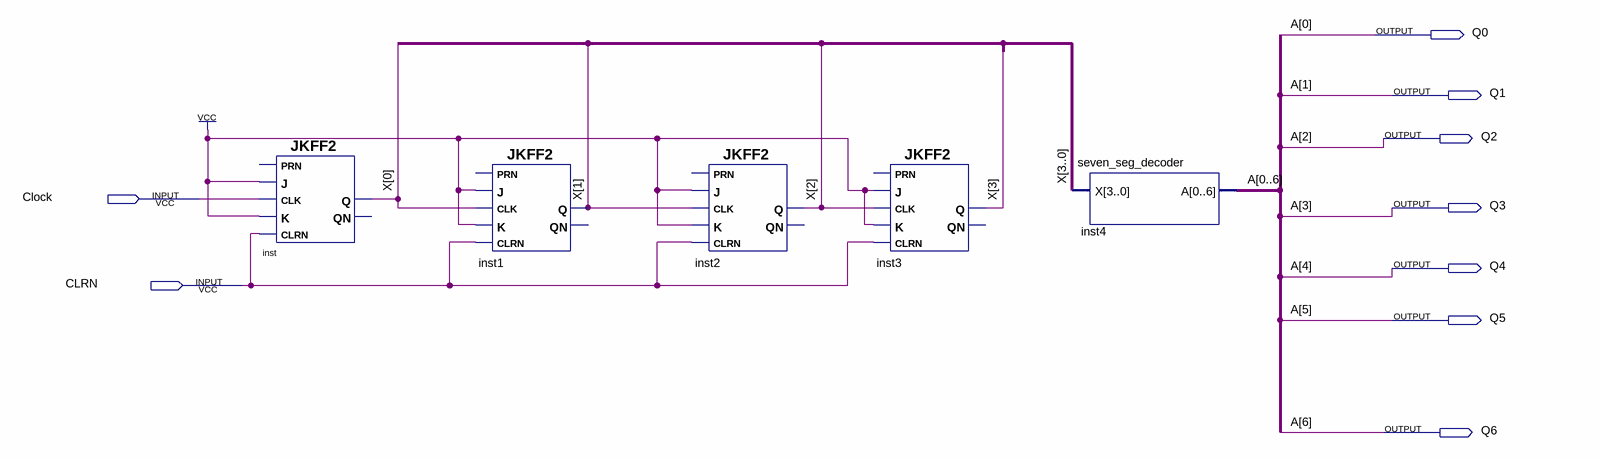
[diagram p0: schematic sheet]
// Quartus schematic lab10step3b.bdf as structural Verilog: 5 symbols, 9 pins
module lab10step3b (
  input  Clock,
  input  CLRN,
  output Q0,
  output Q1,
  output Q2,
  output Q3,
  output Q4,
  output Q5,
  output Q6
);

  wire [3:0] X;

  JKFF2 inst (.K(1'b1), .CLRN(CLRN), .CLK(Clock), .J(1'b1), .Q(X[0]));  // open: PRN, QN
  JKFF2 inst1 (.K(1'b1), .CLRN(CLRN), .CLK(X[0]), .J(1'b1), .Q(X[1]));  // open: PRN, QN
  JKFF2 inst2 (.K(1'b1), .CLRN(CLRN), .CLK(X[1]), .J(1'b1), .Q(X[2]));  // open: PRN, QN
  JKFF2 inst3 (.K(1'b1), .CLRN(CLRN), .CLK(X[2]), .J(1'b1), .Q(X[3]));  // open: PRN, QN
  seven_seg_decoder inst4 (.X(X), .A({Q0, Q1, Q2, Q3, Q4, Q5, Q6}));

  // Other names for the same wires on the sheet: A[6:0] = {Q6, Q5, Q4, Q3, Q2, Q1, Q0}
endmodule
